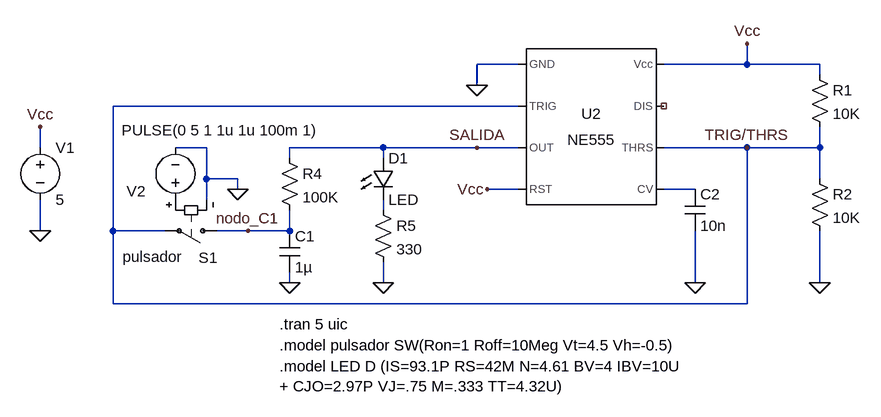
[diagram p0: schematic interruptor electronico.asc]
interruptor electronico.asc, the LTspice schematic file:
Version 4
SHEET 1 1332 680
WIRE 672 96 608 96
WIRE 1024 96 1024 64
WIRE 1024 96 896 96
WIRE 1136 96 1024 96
WIRE 1136 112 1136 96
WIRE 608 128 608 96
WIRE 672 160 48 160
WIRE -64 224 -64 192
WIRE 192 224 144 224
WIRE 464 224 320 224
WIRE 608 224 464 224
WIRE 672 224 608 224
WIRE 1024 224 896 224
WIRE 1136 224 1136 192
WIRE 1136 224 1024 224
WIRE 320 240 320 224
WIRE 464 240 464 224
WIRE 192 272 192 224
WIRE 240 272 192 272
WIRE 1136 272 1136 224
WIRE 240 288 240 272
WIRE 672 288 624 288
WIRE 944 288 896 288
WIRE 192 304 192 272
WIRE 464 320 464 304
WIRE -64 352 -64 304
WIRE 48 352 48 160
WIRE 128 352 48 352
WIRE 256 352 208 352
WIRE 320 352 320 320
WIRE 320 352 256 352
WIRE 320 368 320 352
WIRE 320 432 320 416
WIRE 464 432 464 400
WIRE 944 432 944 352
WIRE 1136 432 1136 352
WIRE 48 464 48 352
WIRE 1024 464 1024 224
WIRE 1024 464 48 464
FLAG -64 352 0
FLAG 944 432 0
FLAG 624 288 Vcc
FLAG 608 224 SALIDA
FLAG 608 128 0
FLAG 320 432 0
FLAG 1024 224 TRIG/THRS
FLAG -64 192 Vcc
FLAG 464 432 0
FLAG 1136 432 0
FLAG 1024 64 Vcc
FLAG 240 288 0
FLAG 256 352 nodo_C1
SYMBOL voltage -64 208 R0
WINDOW 123 0 0 Left 0
WINDOW 39 0 0 Left 0
SYMATTR InstName V1
SYMATTR Value 5
SYMBOL Misc\\NE555 784 192 R0
SYMATTR InstName U2
SYMBOL res 304 224 R0
SYMATTR InstName R4
SYMATTR Value 100K
SYMBOL cap 928 288 R0
SYMATTR InstName C2
SYMATTR Value 10n
SYMBOL cap 304 352 R0
SYMATTR InstName C1
SYMATTR Value 1µ
SYMBOL res 448 304 R0
SYMATTR InstName R5
SYMATTR Value 330
SYMBOL LED 448 240 R0
SYMATTR InstName D1
SYMATTR Value LED
SYMBOL res 1120 96 R0
SYMATTR InstName R1
SYMATTR Value 10K
SYMBOL res 1120 256 R0
SYMATTR InstName R2
SYMATTR Value 10K
SYMBOL voltage 144 320 R180
WINDOW 0 46 29 Left 2
WINDOW 3 -221 123 Left 2
WINDOW 123 0 0 Left 0
WINDOW 39 0 0 Left 0
SYMATTR InstName V2
SYMATTR Value PULSE(0 5 1 1u 1u 100m 1)
SYMBOL sw 224 352 R90
WINDOW 0 41 15 VRight 2
WINDOW 3 40 68 VRight 2
SYMATTR InstName S1
SYMATTR Value pulsador
TEXT 304 496 Left 2 !.tran 5 uic
TEXT 304 560 Left 2 !.model LED D (IS=93.1P RS=42M N=4.61 BV=4 IBV=10U\n+ CJO=2.97P VJ=.75 M=.333 TT=4.32U)
TEXT 304 528 Left 2 !.model pulsador SW(Ron=1 Roff=10Meg Vt=4.5 Vh=-0.5)

The netlist it stands for:
* interruptor electronico.asc
V1 Vcc 0 5
XU2 0 TRIG/THRS SALIDA Vcc N001 TRIG/THRS NC_01 Vcc NE555  ; pins GND TRIG OUT RST CV THRS DIS Vcc
R4 SALIDA nodo_C1 100K
C2 N001 0 10n
C1 nodo_C1 0 1µ
R5 N002 0 330
D1 SALIDA N002 LED
R1 Vcc TRIG/THRS 10K
R2 TRIG/THRS 0 10K
V2 P001 0 PULSE(0 5 1 1u 1u 100m 1)
S1 nodo_C1 TRIG/THRS P001 0 pulsador
.model D D
.lib standard.dio
.tran 5 uic
.model LED D (IS=93.1P RS=42M N=4.61 BV=4 IBV=10U
+ CJO=2.97P VJ=.75 M=.333 TT=4.32U)
.model pulsador SW(Ron=1 Roff=10Meg Vt=4.5 Vh=-0.5)
.lib NE555.sub
.backanno
.end